# EAGLE design FT231-Breakout-v1.0 (EAGLE 6.4)
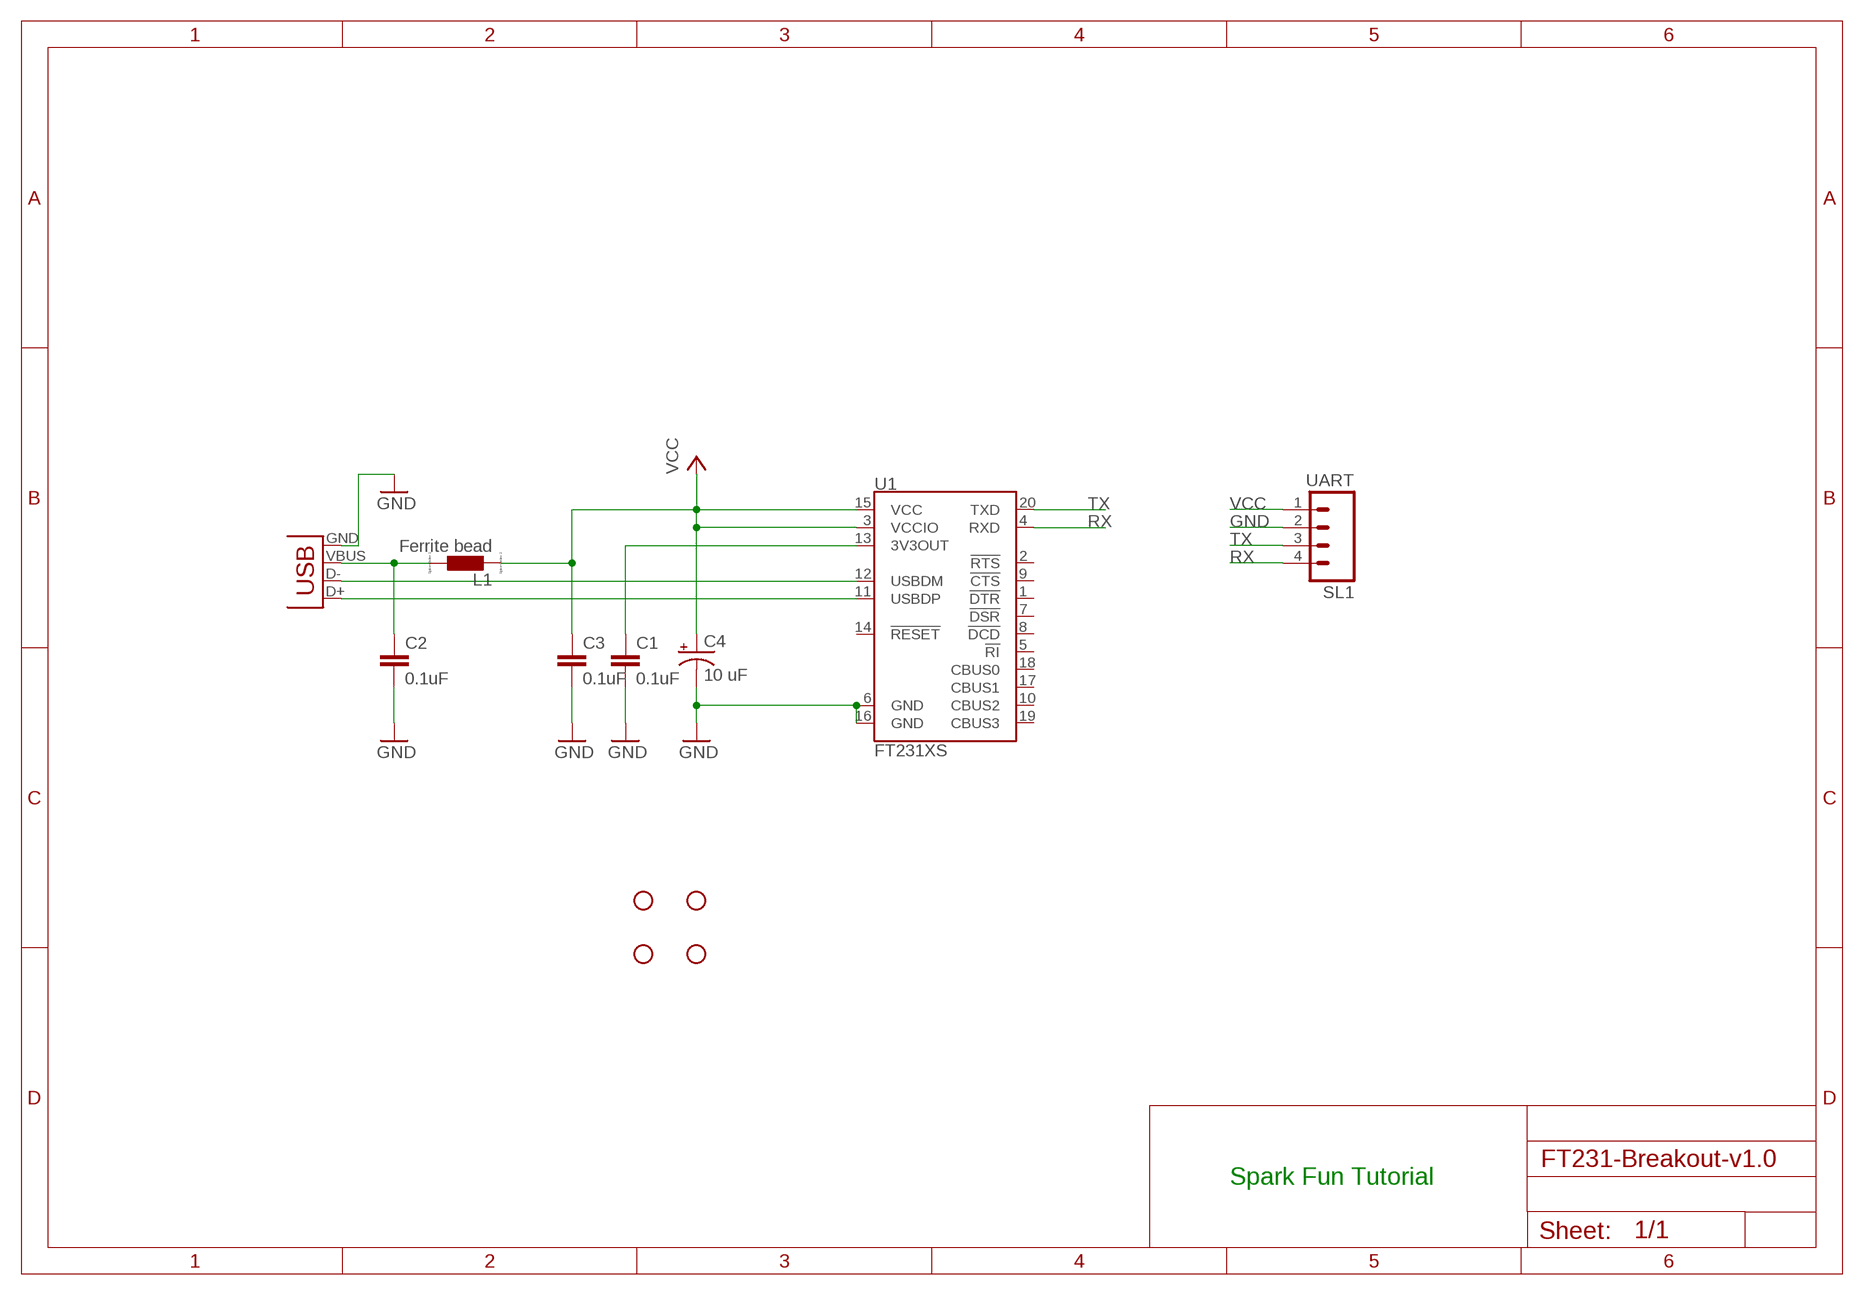
[diagram p0: schematic, sheet 1]

## Parts
C1  0.1uF  0.1UF-25V-5%(0603)  [0603-CAP]
C2  0.1uF  0.1UF-25V-5%(0603)  [0603-CAP]
C3  0.1uF  0.1UF-25V-5%(0603)  [0603-CAP]
C4  10 uF  CAP_POL1206  [EIA3216]
JP1  USB-B  USBPTH  [USB-B-PTH]
L1  Ferrite bead  L  [L1812]
SL1  UART  M04  [04P]
STANDOFF1  STAND-OFF  [STAND-OFF]
STANDOFF2  STAND-OFF  [STAND-OFF]
STANDOFF3  STAND-OFF  [STAND-OFF]
STANDOFF4  STAND-OFF  [STAND-OFF]
U1  FT231XS  [SSOP20_L]

## Nets
GND: C1.2 C2.2 C3.2 C4.C(-) JP1.GND SL1.2 U1.6(GND) U1.16(GND)
N$1: JP1.D- U1.12(USBDM)
N$2: JP1.D+ U1.11(USBDP)
N$3: C1.1 U1.13(3V3OUT)
N$4: C2.1 JP1.VBUS L1.1
RX: SL1.4 U1.4(RXD)
TX: SL1.3 U1.20(TXD)
VCC: C3.1 C4.A(+) L1.2 SL1.1 U1.3(VCCIO) U1.15(VCC)
Unconnected: U1.1(!DTR) U1.2(!RTS) U1.5(!RI) U1.7(!DSR) U1.8(!DCD) U1.9(!CTS) U1.10(CBUS2) U1.14(!RESET) U1.17(CBUS1) U1.18(CBUS0) U1.19(CBUS3)

## Notes on the sheet
- Spark Fun Tutorial

## Library data of the parts
C1-C3 = SparkFun-Capacitors:0.1UF-25V-5%(0603): CAP-08604; PROD_ID: CAP-08604
C4 = SparkFun-Capacitors:CAP_POL: Capacitor Polarized These are standard SMD and PTH capacitors. Normally 10uF, 47uF, and 100uF in electrolytic and tantalum varieties. Always verify the external diameter of the through hole cap, it varies with capacity, voltage, and manufacturer. The EIA devices should be standard.
JP1 = SparkFun-Connectors:USB: USB Connectors USB-B-PTH is fully proven SKU : PRT-00139/CONN-08278 USB-miniB is fully proven SKU : PRT-00587 USB-A-PCB is untested. USB-A-H is throughly reviewed, but untested. Spark Fun Electronics SKU : PRT-00437 USB-B-SMT is throughly reviewed, but untested. Needs silkscreen touching up. USB-A-S has not been used/tested USB-MB-H has not been used/tested USB-MICROB has been used. CONN-09505; PROD_ID: CONN-08278
L1 = eagle-ltspice:L: INDUCTOR, European symbol; SPICEMODEL: NONE; SPICEPREFIX: L
SL1 = con-amp-quick:M04: AMP QUICK CONNECTOR; OC_FARNELL: unknown; OC_NEWARK: unknown
STANDOFF1-STANDOFF4 = SparkFun-Electromechanical:STAND-OFF: #4 Stand Off This is the mechanical footprint for a #4 phillips button head screw. Use the keepout ring to avoid running the screw head into surrounding components. SKU : PRT-00447
U1 = SparkFun-DigitalIC:FT231X: FTDI FT231X Full Speed USB to Full-handshake UART This USB2.0 Full Speed IC offers a compact bridge to full handshake UART interfaces. The device is a UART, capable of operating up to 3MBaud, with low power consumption (8mA). The FT231X includes the complete FT-X series feature set and enables USB to be added into a system design quickly and easily over a UART interface.

## Board
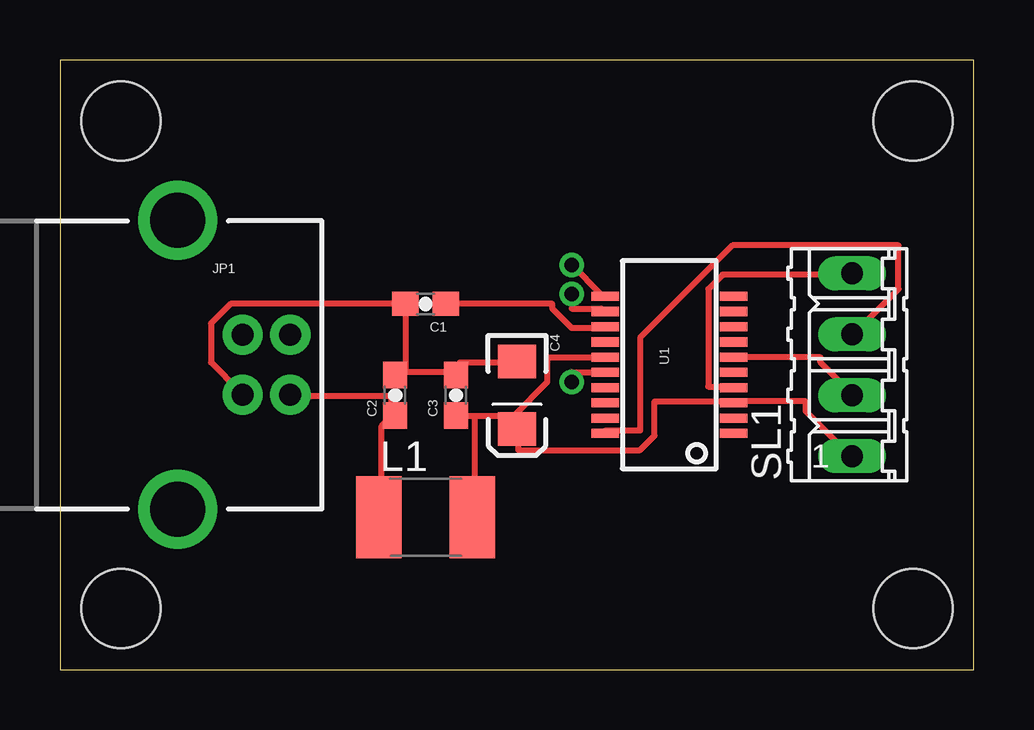
[diagram p1: board, top side]
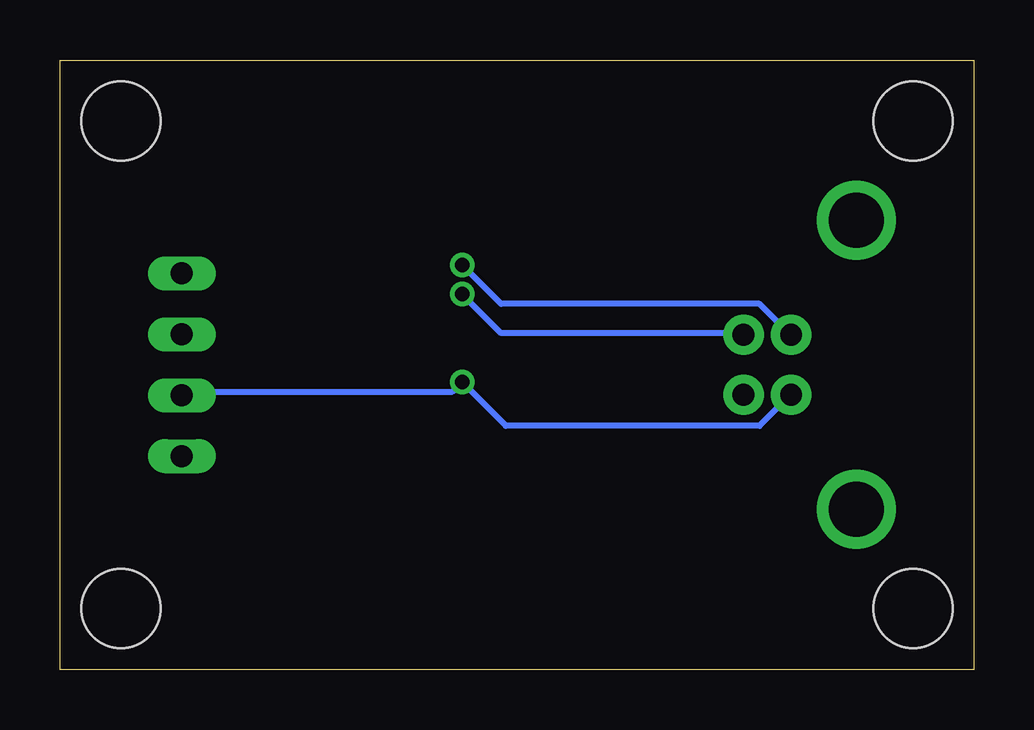
[diagram p2: board, bottom side, seen from below]

Size 38.1 x 25.4 mm. Coordinates in mm from the lower left corner, seen from the top.
Outline: 0,0 38.1,0 38.1,25.4 0,25.4 0,0
Copper layers (1*16): Top 0.035mm / dielectric 1.5mm / Bottom 0.035mm
Design rules "default": minimum track width 10mil, minimum drill 24mil, track to track 8mil, track to pad 8mil, pad to pad 8mil, via to via 8mil, smd to smd 8mil, copper to edge 40mil, drill to drill 8mil, minimum pad ring 10mil, minimum via ring 8mil, stop-mask expansion 4mil, vias tented up to drill 0mil, thermal gap 10mil

### Footprints (pad centres in the part's own frame; a part is rotated, then mirrored left to right if it is on the bottom)
0603-CAP = smd 1.1 x 1: 1 -0.85,0; 2 0.85,0
EIA3216 = smd 1.4 x 1.6: A 1.4,0; C -1.4,0
USB-B-PTH = drill 0.914 pad 1.676: D+ 0,1.25; D- 1.981,1.25; GND 0,-1.25; VBUS 1.981,-1.25 | drill 2.286: S1 -2.718,-6.02; S2 -2.718,6.02
L1812 = smd 1.9 x 3.4: 1 -1.95,0; 2 1.95,0
04P = drill 0.914 long: 1 -3.81,0; 2 -1.27,0; 3 1.27,0; 4 3.81,0
STAND-OFF = hole 3.302: 0,0
SSOP20_L = smd 0.381 x 1.143: 1 -2.857,-2.68; 2 -2.223,-2.68; 3 -1.587,-2.68; 4 -0.953,-2.68; 5 -0.318,-2.68; 6 0.318,-2.68; 7 0.953,-2.68; 8 1.587,-2.68; 9 2.223,-2.68; 10 2.857,-2.68; 11 2.857,2.68; 12 2.223,2.68; 13 1.587,2.68; 14 0.953,2.68; 15 0.318,2.68; 16 -0.318,2.68; 17 -0.953,2.68; 18 -1.587,2.68; 19 -2.223,2.68; 20 -2.857,2.68

### Placement (x,y rotation side)
C1  15.24,15.24 180 top
C2  13.97,11.43 90 top
C3  16.51,11.43 90 top
C4  19.05,11.43 270 top
JP1  7.62,12.7 0 top
L1  15.24,6.35 0 top
SL1  33.02,12.7 90 top
STANDOFF1  35.56,2.54 0 top
STANDOFF2  35.56,22.86 0 top
STANDOFF3  2.54,2.54 0 top
STANDOFF4  2.54,22.86 90 top
U1  25.4,12.7 90 top

### Tracks (layer width: path | path; a pad name or v marks a point on that pad's centre or on a via)
GND  (via drill 0.61)
  Top 0.254: v21.34,11.99 21.34,12.39 22.55,12.39 U1.16 | U1.6 28.25,13.01 31.7,13.01 31.7,12.8 32.92,11.58 SL1.2 | 14.43,12.39 16.46,12.39 C3.2 16.66,12.39 16.66,12.8 18.9,12.8 C4.C | 14.43,12.39 14.02,12.39 C2.2 14.43,12.39 | 14.43,12.39 14.43,15.24 C1.2 7.11,15.24 6.3,14.43 6.3,12.8 7.52,11.58 JP1.GND
  Bottom 0.254: SL1.2 32.92,11.58 21.74,11.58 v21.34,11.99 19.51,10.16 8.94,10.16 7.72,11.38 JP1.GND
N$1  (via drill 0.61)
  Top 0.254: v21.34,15.65 21.34,15.04 22.55,15.04 U1.12
  Bottom 0.254: v21.34,15.65 19.71,14.02 9.75,14.02 JP1.D-
N$2  (via drill 0.61)
  Top 0.254: v21.34,16.87 22.55,15.65 U1.11
  Bottom 0.254: v21.34,16.87 19.71,15.24 8.94,15.24 7.72,14.02 JP1.D+
N$3
  Top 0.254: C1.1 20.52,15.24 20.52,15.04 21.34,14.22 22.55,14.22 U1.13
N$4
  Top 0.254: L1.1 13.41,6.5 13.41,10.16 13.82,10.57 C2.1 13.82,10.77 13.82,11.38 9.75,11.38 JP1.VBUS
RX
  Top 0.254: U1.4 28.04,11.79 27.03,11.79 27.03,15.85 27.64,16.46 32.92,16.46 SL1.4
TX
  Top 0.254: U1.20 22.76,9.96 24.18,9.96 24.18,13.82 28.04,17.68 34.95,17.68 34.95,15.85 33.12,14.02 SL1.3
VCC
  Top 0.254: SL1.1 32.92,8.94 31.09,10.77 31.09,11.18 28.25,11.18 U1.3 28.04,11.18 24.79,11.18 24.79,9.75 24.18,9.14 19.1,9.14 19.1,9.96 C4.A | 18.9,10.57 17.27,10.57 | 17.27,10.57 16.66,10.57 C3.1 | 18.9,10.57 18.9,10.16 C4.A | 18.9,10.57 20.32,11.99 20.32,13.01 22.55,13.01 U1.15 | 18.9,10.57 C4.A | 17.27,10.57 17.27,6.5 L1.2